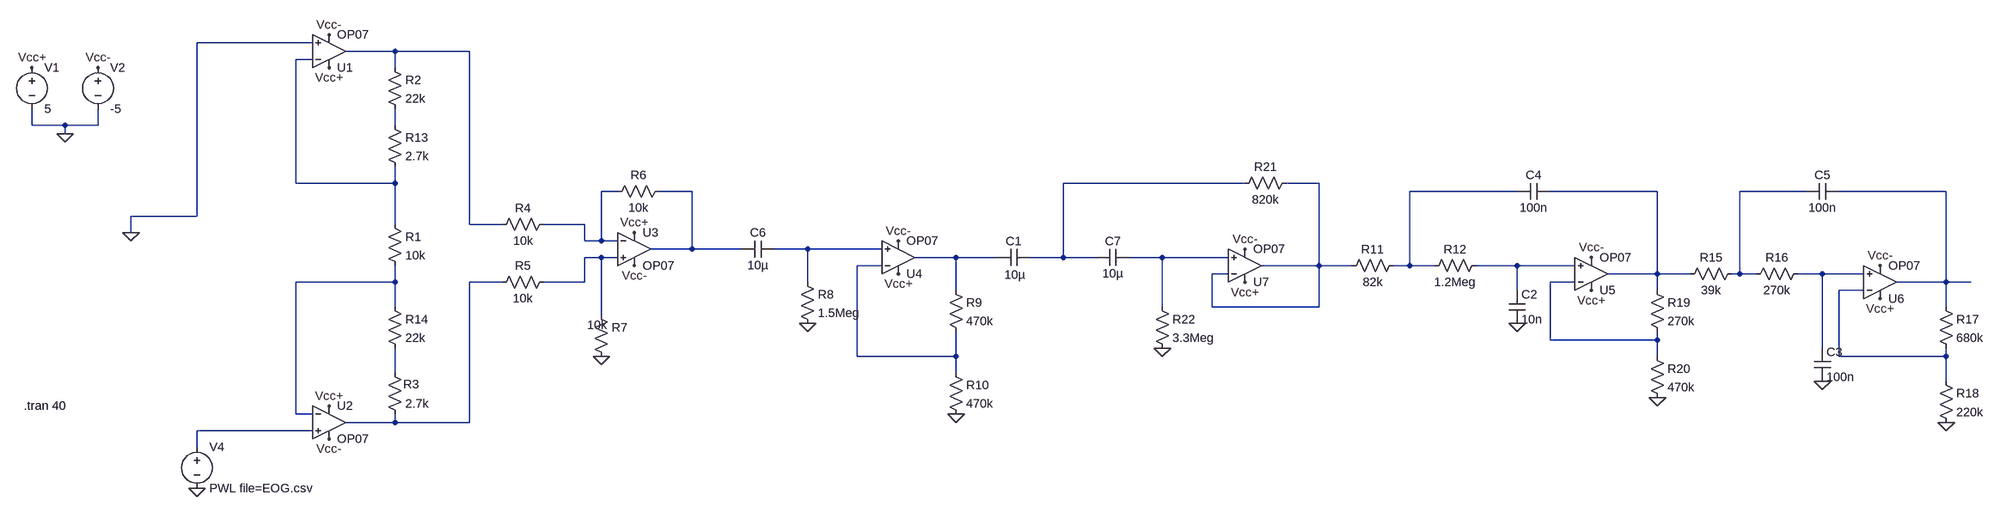
[diagram p0: schematic prva_sema.asc]
prva_sema.asc, the LTspice schematic file:
Version 4
SHEET 1 3168 836
WIRE -80 -144 -304 -144
WIRE 80 -128 -16 -128
WIRE 224 -128 80 -128
WIRE -80 -112 -112 -112
WIRE 80 -96 80 -128
WIRE -624 16 -624 -16
WIRE -560 16 -624 16
WIRE -496 16 -496 -16
WIRE -496 16 -560 16
WIRE 80 16 80 -16
WIRE -560 32 -560 16
WIRE -112 128 -112 -112
WIRE 80 128 80 96
WIRE 80 128 -112 128
WIRE 1728 128 1376 128
WIRE 1872 128 1808 128
WIRE 512 144 480 144
WIRE 656 144 592 144
WIRE 2256 144 2048 144
WIRE 2528 144 2320 144
WIRE 2816 144 2688 144
WIRE 3088 144 2880 144
WIRE -304 192 -304 -144
WIRE -304 192 -432 192
WIRE 80 208 80 128
WIRE 224 208 224 -128
WIRE 288 208 224 208
WIRE 448 208 368 208
WIRE -432 224 -432 192
WIRE 448 240 448 208
WIRE 480 240 480 144
WIRE 480 240 448 240
WIRE 512 240 480 240
WIRE 656 256 656 144
WIRE 656 256 576 256
WIRE 752 256 656 256
WIRE 880 256 816 256
WIRE 1024 256 880 256
WIRE 480 272 448 272
WIRE 512 272 480 272
WIRE 1168 272 1088 272
WIRE 1248 272 1168 272
WIRE 1376 272 1376 128
WIRE 1376 272 1312 272
WIRE 1440 272 1376 272
WIRE 1568 272 1504 272
WIRE 1696 272 1568 272
WIRE 1024 288 976 288
WIRE 1872 288 1872 128
WIRE 1872 288 1760 288
WIRE 1936 288 1872 288
WIRE 2048 288 2048 144
WIRE 2048 288 2016 288
WIRE 2096 288 2048 288
WIRE 2256 288 2176 288
WIRE 2368 288 2256 288
WIRE 1696 304 1664 304
WIRE 2528 304 2528 144
WIRE 2528 304 2432 304
WIRE 2592 304 2528 304
WIRE 2688 304 2688 144
WIRE 2688 304 2672 304
WIRE 2720 304 2688 304
WIRE 2848 304 2800 304
WIRE 2928 304 2848 304
WIRE 80 320 80 288
WIRE 80 320 -112 320
WIRE 288 320 224 320
WIRE 448 320 448 272
WIRE 448 320 368 320
WIRE 880 320 880 256
WIRE 2368 320 2320 320
WIRE 3088 320 3088 144
WIRE 3088 320 2992 320
WIRE 3136 320 3088 320
WIRE 1168 336 1168 272
WIRE 2256 336 2256 288
WIRE 2528 336 2528 304
WIRE 2928 336 2880 336
WIRE 80 368 80 320
WIRE 1568 368 1568 272
WIRE 1664 368 1664 304
WIRE 1872 368 1872 288
WIRE 1872 368 1664 368
WIRE 3088 368 3088 320
WIRE 480 384 480 272
WIRE 2320 432 2320 320
WIRE 2528 432 2528 416
WIRE 2528 432 2320 432
WIRE 2848 448 2848 304
WIRE 976 464 976 288
WIRE 1168 464 1168 416
WIRE 1168 464 976 464
WIRE 2528 464 2528 432
WIRE 2880 464 2880 336
WIRE 3088 464 3088 448
WIRE 3088 464 2880 464
WIRE 80 496 80 448
WIRE 1168 496 1168 464
WIRE 3088 512 3088 464
WIRE -112 576 -112 320
WIRE -80 576 -112 576
WIRE 80 592 80 576
WIRE 80 592 -16 592
WIRE 224 592 224 320
WIRE 224 592 80 592
WIRE -80 608 -304 608
WIRE -304 640 -304 608
FLAG -560 32 0
FLAG 480 464 0
FLAG -624 -96 Vcc+
FLAG -48 -96 Vcc+
FLAG -48 560 Vcc+
FLAG 544 224 Vcc+
FLAG -48 -160 Vcc-
FLAG -48 624 Vcc-
FLAG -496 -96 Vcc-
FLAG 544 288 Vcc-
FLAG -432 224 0
FLAG 1056 304 Vcc+
FLAG 1056 240 Vcc-
FLAG 2400 336 Vcc+
FLAG 2400 272 Vcc-
FLAG -304 720 0
FLAG 880 400 0
FLAG 1168 576 0
FLAG 2256 400 0
FLAG 2848 512 0
FLAG 3088 592 0
FLAG 2528 544 0
FLAG 2960 352 Vcc+
FLAG 2960 288 Vcc-
FLAG 1568 448 0
FLAG 1728 320 Vcc+
FLAG 1728 256 Vcc-
SYMBOL voltage -624 -112 R0
WINDOW 123 0 0 Left 0
WINDOW 39 0 0 Left 0
SYMATTR InstName V1
SYMATTR Value 5
SYMBOL voltage -496 -112 R0
WINDOW 123 0 0 Left 0
WINDOW 39 0 0 Left 0
SYMATTR InstName V2
SYMATTR Value -5
SYMBOL OpAmps\\OP07 -48 528 R0
SYMATTR InstName U2
SYMBOL OpAmps\\OP07 544 192 R0
SYMATTR InstName U3
SYMBOL res 64 192 R0
SYMATTR InstName R1
SYMATTR Value 10k
SYMBOL res 64 -112 R0
SYMATTR InstName R2
SYMATTR Value 22k
SYMBOL res 64 480 R0
WINDOW 0 32 38 Left 2
SYMATTR InstName R3
SYMATTR Value 2.7k
SYMBOL res 384 192 R90
WINDOW 0 0 56 VBottom 2
WINDOW 3 32 55 VTop 2
SYMATTR InstName R4
SYMATTR Value 10k
SYMBOL res 384 304 R90
WINDOW 0 0 56 VBottom 2
WINDOW 3 32 56 VTop 2
SYMATTR InstName R5
SYMATTR Value 10k
SYMBOL res 608 128 R90
WINDOW 0 0 56 VBottom 2
WINDOW 3 32 56 VTop 2
SYMATTR InstName R6
SYMATTR Value 10k
SYMBOL res 464 368 R0
WINDOW 3 -11 35 Left 2
SYMATTR Value 10k
SYMATTR InstName R7
SYMBOL OpAmps\\OP07 -48 -64 M180
SYMATTR InstName U1
SYMBOL voltage -304 624 R0
WINDOW 123 0 0 Left 0
WINDOW 39 0 0 Left 0
SYMATTR InstName V4
SYMATTR Value PWL file=EOG.csv
SYMBOL OpAmps\\OP07 1056 336 M180
SYMATTR InstName U4
SYMBOL OpAmps\\OP07 2400 368 M180
SYMATTR InstName U5
SYMBOL res 64 0 R0
SYMATTR InstName R13
SYMATTR Value 2.7k
SYMBOL res 64 352 R0
SYMATTR InstName R14
SYMATTR Value 22k
SYMBOL cap 1312 256 R90
WINDOW 0 0 32 VBottom 2
WINDOW 3 34 30 VTop 2
SYMATTR InstName C1
SYMATTR Value 10µ
SYMBOL res 864 304 R0
SYMATTR InstName R8
SYMATTR Value 1.5Meg
SYMBOL res 1152 320 R0
SYMATTR InstName R9
SYMATTR Value 470k
SYMBOL res 1152 480 R0
SYMATTR InstName R10
SYMATTR Value 470k
SYMBOL OpAmps\\OP07 2960 384 M180
SYMATTR InstName U6
SYMBOL cap 2240 336 R0
SYMATTR InstName C2
SYMATTR Value 10n
SYMBOL cap 2832 448 R0
SYMATTR InstName C3
SYMATTR Value 100n
SYMBOL cap 2320 128 R90
WINDOW 0 0 32 VBottom 2
WINDOW 3 32 32 VTop 2
SYMATTR InstName C4
SYMATTR Value 100n
SYMBOL cap 2880 128 R90
WINDOW 0 0 32 VBottom 2
WINDOW 3 32 32 VTop 2
SYMATTR InstName C5
SYMATTR Value 100n
SYMBOL res 2032 272 R90
WINDOW 0 0 56 VBottom 2
WINDOW 3 32 56 VTop 2
SYMATTR InstName R11
SYMATTR Value 82k
SYMBOL res 2192 272 R90
WINDOW 0 0 56 VBottom 2
WINDOW 3 32 56 VTop 2
SYMATTR InstName R12
SYMATTR Value 1.2Meg
SYMBOL res 2688 288 R90
WINDOW 0 0 56 VBottom 2
WINDOW 3 32 56 VTop 2
SYMATTR InstName R15
SYMATTR Value 39k
SYMBOL res 2816 288 R90
WINDOW 0 0 56 VBottom 2
WINDOW 3 32 56 VTop 2
SYMATTR InstName R16
SYMATTR Value 270k
SYMBOL res 3072 352 R0
SYMATTR InstName R17
SYMATTR Value 680k
SYMBOL res 3072 496 R0
SYMATTR InstName R18
SYMATTR Value 220k
SYMBOL res 2512 320 R0
SYMATTR InstName R19
SYMATTR Value 270k
SYMBOL res 2512 448 R0
SYMATTR InstName R20
SYMATTR Value 470k
SYMBOL cap 816 240 R90
WINDOW 0 0 32 VBottom 2
WINDOW 3 32 32 VTop 2
SYMATTR InstName C6
SYMATTR Value 10µ
SYMBOL res 1824 112 R90
WINDOW 0 0 56 VBottom 2
WINDOW 3 32 56 VTop 2
SYMATTR InstName R21
SYMATTR Value 820k
SYMBOL cap 1504 256 R90
WINDOW 0 0 32 VBottom 2
WINDOW 3 32 32 VTop 2
SYMATTR InstName C7
SYMATTR Value 10µ
SYMBOL res 1552 352 R0
SYMATTR InstName R22
SYMATTR Value 3.3Meg
SYMBOL OpAmps\\OP07 1728 352 M180
SYMATTR InstName U7
TEXT -640 560 Left 2 !.tran 40

The netlist it stands for:
* prva_sema.asc
V1 Vcc+ 0 5
V2 Vcc- 0 -5
XU2 N024 N019 Vcc+ Vcc- N020 LT1001  ; OP07, pins In+ In- V+ V- OUT
XU3 N013 N006 Vcc+ Vcc- N007 LT1001  ; OP07, pins In+ In- V+ V- OUT
R1 N002 N019 10k
R2 N001 N003 22k
R3 N023 N020 2.7k
R4 N006 N001 10k
R5 N013 N020 10k
R6 N007 N006 10k
R7 N013 0 10k
XU1 0 N002 Vcc+ Vcc- N001 LT1001  ; OP07, pins In+ In- V+ V- OUT
V4 N024 0 PWL file=EOG.csv
XU4 N012 N016 Vcc+ Vcc- N014 LT1001  ; OP07, pins In+ In- V+ V- OUT
XU5 N017 N021 Vcc+ Vcc- N009 LT1001  ; OP07, pins In+ In- V+ V- OUT
R13 N003 N002 2.7k
R14 N019 N023 22k
C1 N004 N014 10µ
R8 N012 0 1.5Meg
R9 N014 N016 470k
R10 N016 0 470k
XU6 N018 N022 Vcc+ Vcc- N011 LT1001  ; OP07, pins In+ In- V+ V- OUT
C2 N017 0 10n
C3 N018 0 100n
C4 N009 N008 100n
C5 N011 N010 100n
R11 N008 N005 82k
R12 N017 N008 1.2Meg
R15 N010 N009 39k
R16 N018 N010 270k
R17 N011 N022 680k
R18 N022 0 220k
R19 N009 N021 270k
R20 N021 0 470k
C6 N012 N007 10µ
R21 N005 N004 820k
C7 N015 N004 10µ
R22 N015 0 3.3Meg
XU7 N015 N005 Vcc+ Vcc- N005 LT1001  ; OP07, pins In+ In- V+ V- OUT
.tran 40
.lib LTC.lib
.backanno
.end